# EAGLE design Recuperaçao (EAGLE 9.6.2)

## Sheet 1 of 3: Microcontrolador recuperação
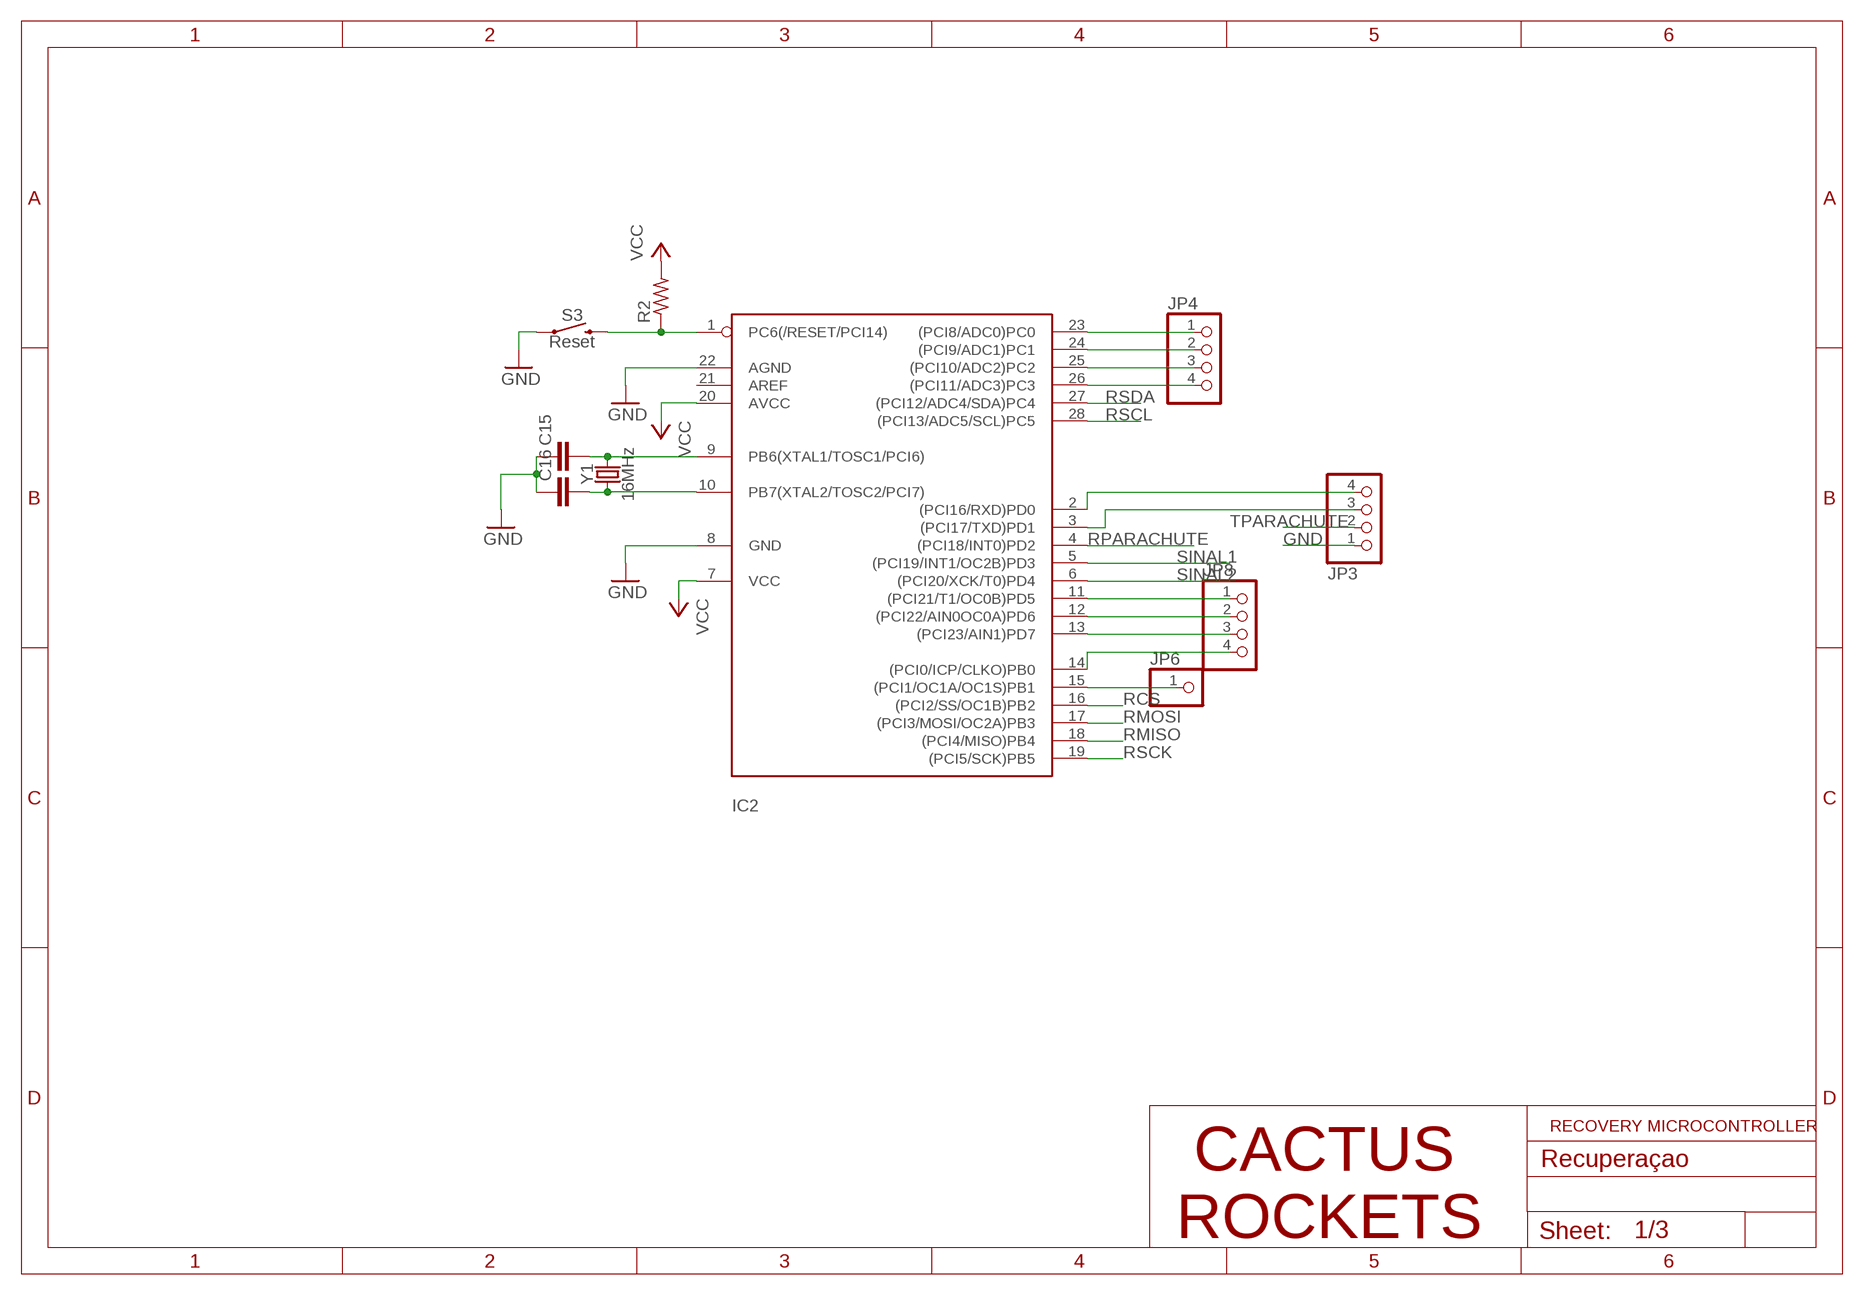
[diagram p0: schematic, sheet 1]

### Parts
C15  C-EU025-025X050  [C025-025X050]
C16  C-EU025-025X050  [C025-025X050]
IC2  ATMEGA328-20P  [DIL28-3]
JP3  PINHD-1X4/90  [1X04/90]
JP4  PINHD-1X4  [1X04]
JP6  PINHD-1X1  [1X01]
JP8  PINHD-1X4  [1X04]
R2  R-US_0207/10  [0207/10]
S3  Reset  MOMENTARY-SWITCH-SPST-PTH-6.0MM  [TACTILE_SWITCH_PTH_6.0MM]
Y1  16MHz  CRYSTAL-16MHZPTH-HC49US  [HC49US]

### Nets
GND: C15.1 C16.1 IC2.8(GND) IC2.22(AGND) JP3.1 S3.1 S3.2 ; also sheet 2,3
N$1: IC2.23((PCI8/ADC0)PC0) JP4.1
N$2: IC2.24((PCI9/ADC1)PC1) JP4.2
N$3: IC2.25((PCI10/ADC2)PC2) JP4.3
N$4: IC2.26((PCI11/ADC3)PC3) JP4.4
N$5: IC2.2((PCI16/RXD)PD0) JP3.4
N$8: IC2.11((PCI21/T1/OC0B)PD5) JP8.1
N$9: IC2.12((PCI22/AIN0OC0A)PD6) JP8.2
N$10: IC2.13((PCI23/AIN1)PD7) JP8.3
N$11: IC2.15((PCI1/OC1A/OC1S)PB1) JP6.1
N$12: IC2.14((PCI0/ICP/CLKO)PB0) JP8.4
N$13: C16.2 IC2.10(PB7(XTAL2/TOSC2/PCI7)) Y1.1
N$14: C15.2 IC2.9(PB6(XTAL1/TOSC1/PCI6)) Y1.2
N$15: IC2.3((PCI17/TXD)PD1) JP3.3
RCS: IC2.16((PCI2/SS/OC1B)PB2) ; also sheet 3
RESET: IC2.1(PC6(/RESET/PCI14)) R2.1 S3.3 S3.4
RMISO: IC2.18((PCI4/MISO)PB4) ; also sheet 3
RMOSI: IC2.17((PCI3/MOSI/OC2A)PB3) ; also sheet 3
RPARACHUTE: IC2.4((PCI18/INT0)PD2)
RSCK: IC2.19((PCI5/SCK)PB5) ; also sheet 3
RSCL: IC2.28((PCI13/ADC5/SCL)PC5) ; also sheet 2
RSDA: IC2.27((PCI12/ADC4/SDA)PC4) ; also sheet 2
SINAL1: IC2.5((PCI19/INT1/OC2B)PD3)
SINAL2: IC2.6((PCI20/XCK/T0)PD4)
TPARACHUTE: JP3.2
VCC: IC2.7(VCC) IC2.20(AVCC) R2.2 ; also sheet 2,3
Unconnected: IC2.21(AREF)

### Notes on the sheet
- RECOVERY MICROCONTROLLER
- CACTUS
  ROCKETS

## Sheet 2 of 3: MPU-6050
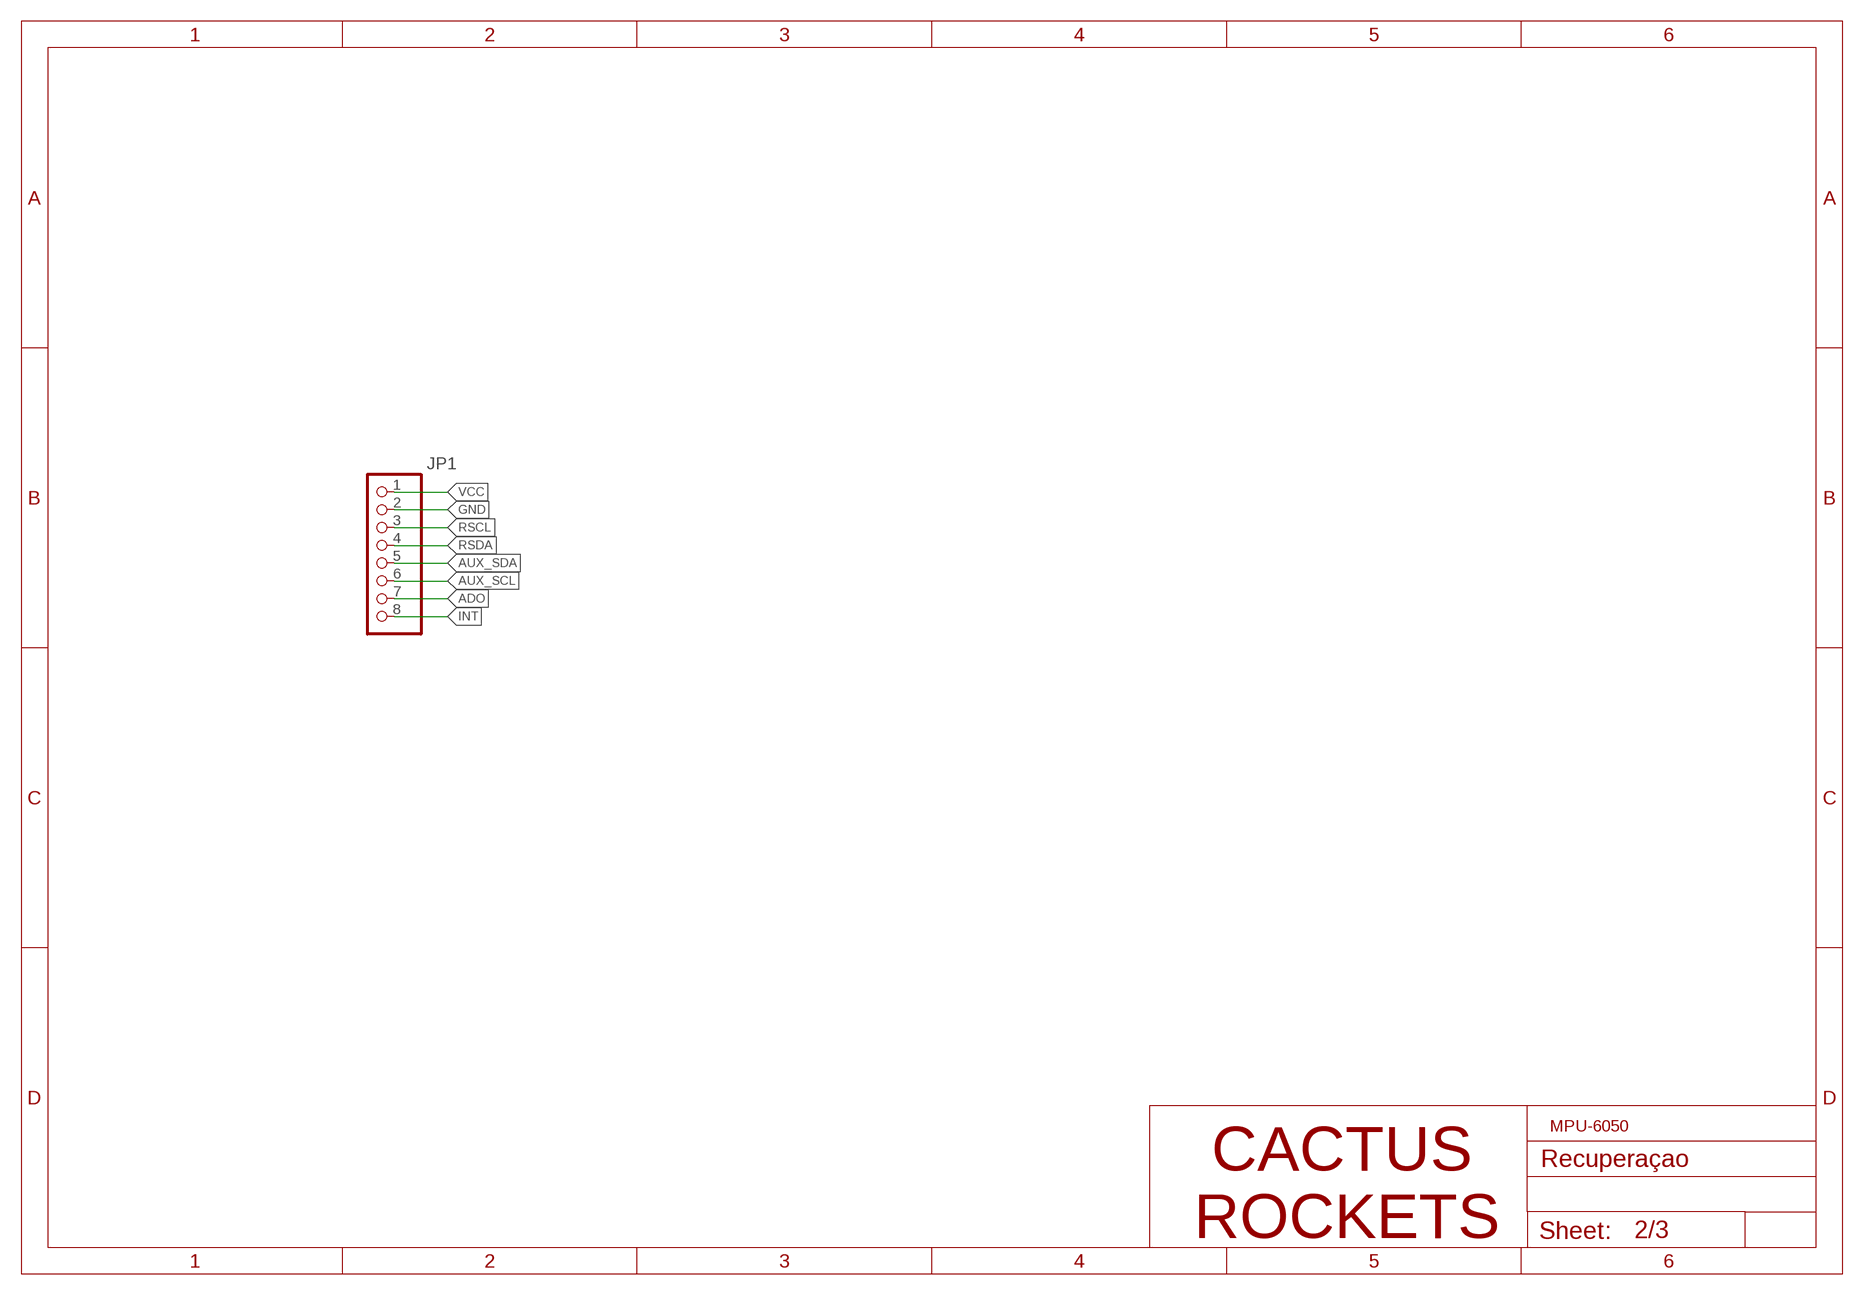
[diagram p1: schematic, sheet 2]

### Parts
JP1  PINHD-1X8  [1X08]

### Nets
ADO: JP1.7
AUX_SCL: JP1.6
AUX_SDA: JP1.5
GND: JP1.2 ; also sheet 1,3
INT: JP1.8
RSCL: JP1.3 ; also sheet 1
RSDA: JP1.4 ; also sheet 1
VCC: JP1.1 ; also sheet 1,3

### Notes on the sheet
- MPU-6050
- CACTUS
  ROCKETS

## Sheet 3 of 3: BMP280
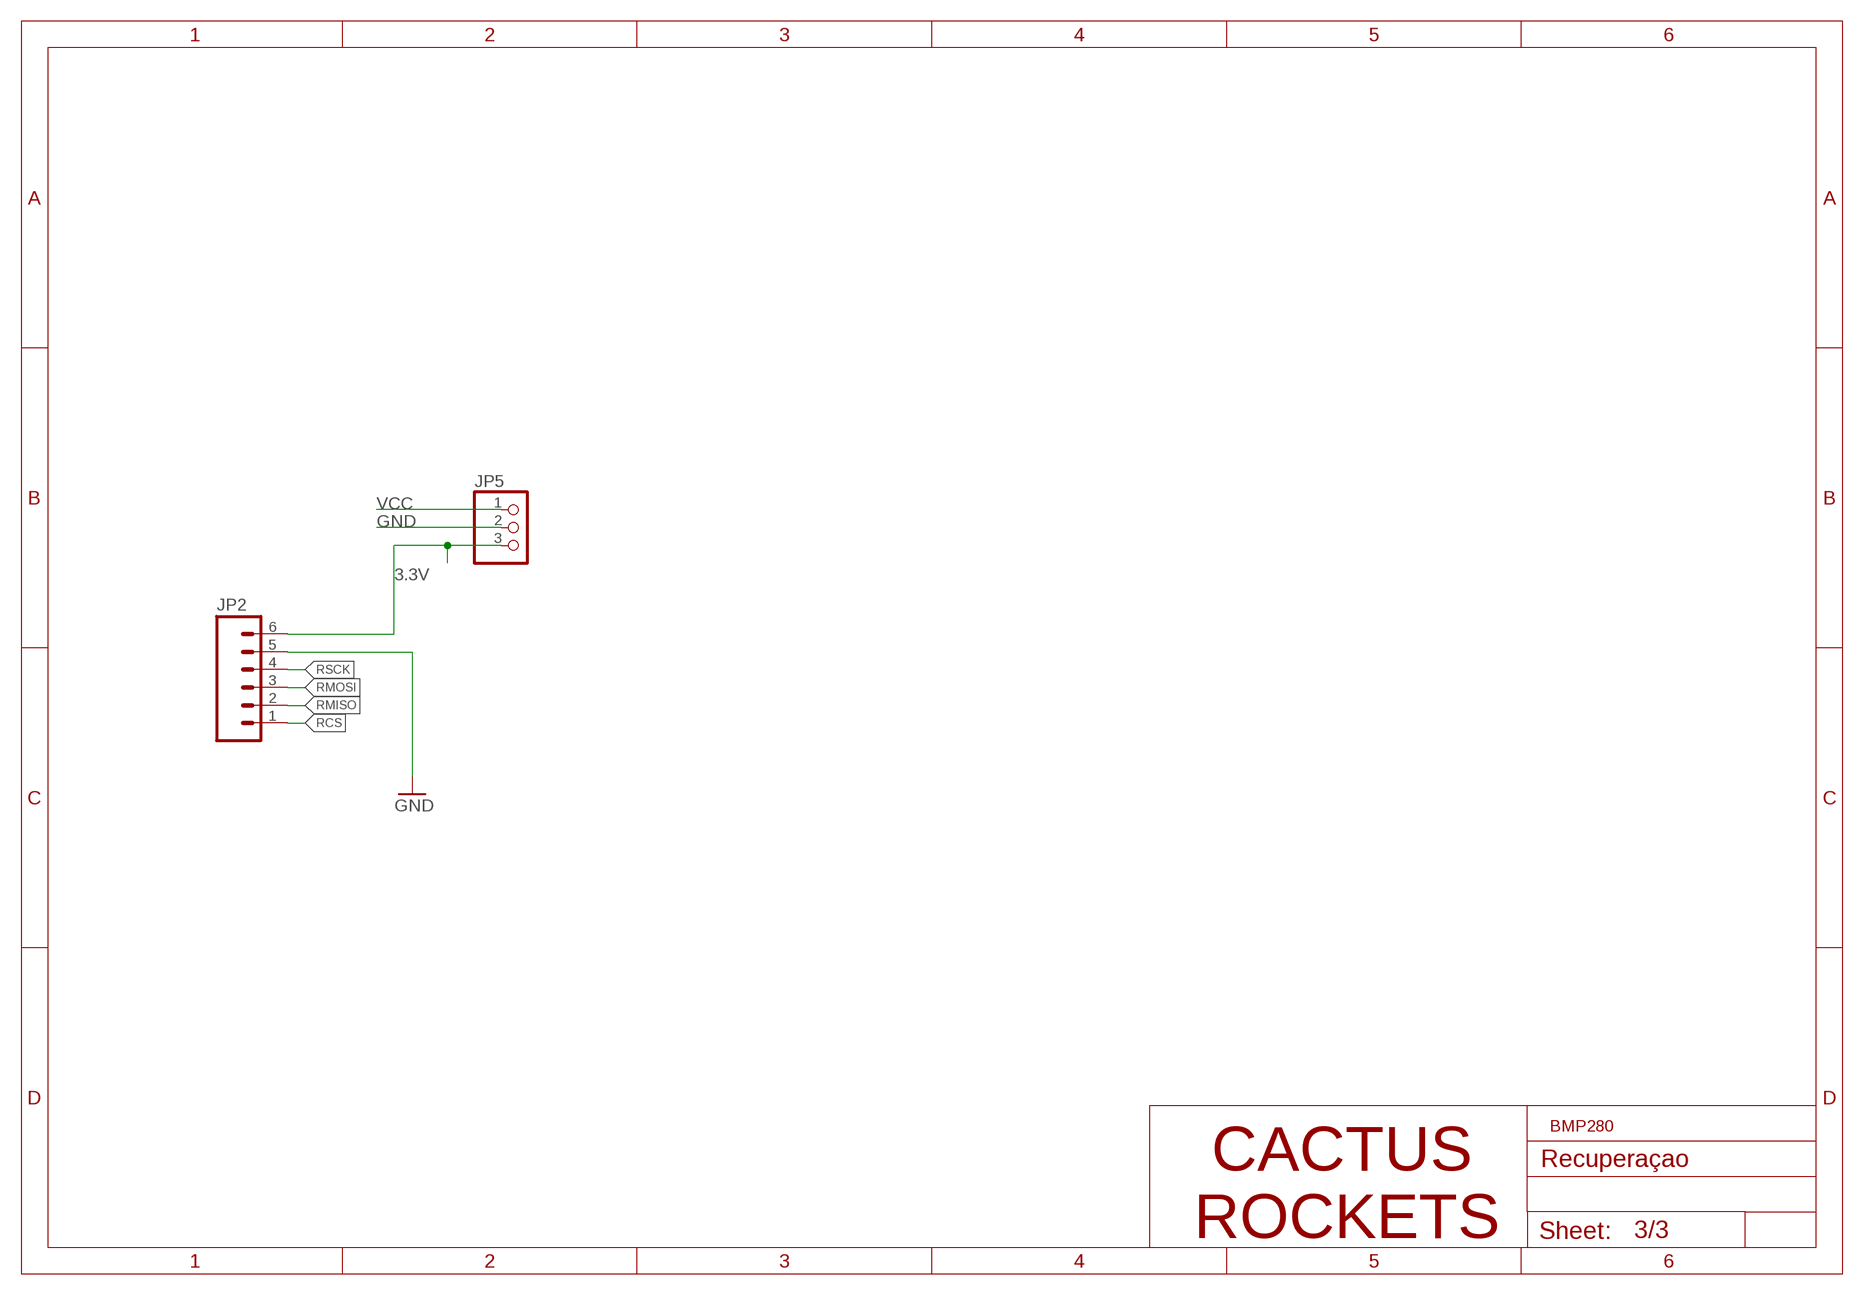
[diagram p2: schematic, sheet 3]

### Parts
JP2  M06NO_SILK_FEMALE_PTH  [1X06_NO_SILK]
JP5  PINHD-1X3/90  [1X03/90]

### Nets
3.3V: JP2.6 JP5.3
GND: JP2.5 JP5.2 ; also sheet 1,2
RCS: JP2.1 ; also sheet 1
RMISO: JP2.2 ; also sheet 1
RMOSI: JP2.3 ; also sheet 1
RSCK: JP2.4 ; also sheet 1
VCC: JP5.1 ; also sheet 1,2

### Notes on the sheet
- BMP280
- CACTUS
  ROCKETS

## Library data of the parts
C15 C16 = rcl:C-EU: CAPACITOR, European symbol; SPICEPREFIX: C
IC2 = atmega328:ATMEGA328*P: MICROCONTROLLER 32 kBytes FLASH 2 kBytes SRAM 1 kBytes EEPROM USART 8-channel 10 bit ADC
JP1 = pinhead:PINHD-1X8: PIN HEADER
JP2 = SparkFun-Connectors:M06: Header 6 Standard 6-pin 0.1" header. Use with straight break away headers (SKU : PRT-00116), right angle break away headers (PRT-00553), swiss pins (PRT-00743), machine pins (PRT-00117), and female headers (PRT-00115). Molex polarized connector foot print use with SKU : PRT-08094 with associated crimp pins and housings. NOTES ON THE VARIANTS LOCK and LOCK_LONGPADS... This footprint was designed to help hold the alignment of a through-hole component (i.e. 6-pin header) while soldering it into place. You may notice that each hole has been shifted either up or down by 0.005 of an inch from it's more standard position (which is a perfectly straight line). This slight alteration caused the pins (the squares in the middle) to touch the edges of the holes. Because they are alternating, it causes a "brace" to hold the component in place. 0.005 has proven to be the perfect amount of "off-center" position when using our standard breakaway headers. Although looks a little odd when you look at the bare footprint, once you have a header in there, the alteration is very hard to notice. Also,if you push a header all the way into place, it is covered up entirely on the bottom side. This idea of altering the position of holes to aid alignment will be further integrated into the Sparkfun Library for other footprints. It can help hold any component with 3 or more connection pins.; PROD_ID: CONN-08437
JP3 JP4 JP8 = pinhead:PINHD-1X4: PIN HEADER
JP5 = pinhead:PINHD-1X3: PIN HEADER
JP6 = pinhead:PINHD-1X1: PIN HEADER
R2 = rcl:R-US_: RESISTOR, American symbol; SPICEPREFIX: R
S3 = SparkFun-Switches:MOMENTARY-SWITCH-SPST: Momentary Switch (Pushbutton) - SPST Normally-open (NO) SPST momentary switches (buttons, pushbuttons). Variants PTH-12MM - 12mm square, through-hole Momentary Pushbutton Switch - 12mm Square <https://www.sparkfun.com/products/9190> (COM-09190) PTH-6.0MM, PTH-6.0MM-KIT - 6.0mm square, through-hole Mini Pushbutton Switch <https://www.sparkfun.com/products/97> (COM-00097) KIT package intended for soldering kit's - only one side of pads' copper is exposed. PTH-RIGHT-ANGLE-KIT - Right-angle, through-hole Right Angle Tactile Button <https://www.sparkfun.com/products/10791> - Used on SparkFun BigTime Watch Kit <https://www.sparkfun.com/products/11734> SMD-12MM - 12mm square, surface-mount Tactile Button - SMD (12mm) <https://www.sparkfun.com/products/12993> (COM-12993) Used on SparkFun PicoBoard <https://www.sparkfun.com/products/11888> SMD-4.5MM - 4.5mm Square Trackball Switch Used on SparkFun Blackberry Trackballer Breakout <https://www.sparkfun.com/products/13169> SMD-4.6MMX2.8MM - 4.60mm x 2.80mm, surface mount Used on SparkFun Pro Micro - RP2040 <https://www.sparkfun.com/products/17717> SMD-5.2MM, SMD-5.2-REDUNDANT - 5.2mm square, surface-mount Mini Pushbutton Switch - SMD <https://www.sparkfun.com/products/8720> (COM-08720) Used on Arduino Pro Mini <https://www.sparkfun.com/products/11114> REDUNDANT package connects both switch circuits together SMD-6.0X3.5MM - 6.0 x 3.5mm, surface mount Momentary Reset Switch SMD <https://www.sparkfun.com/products/8229> (COM-08229) SMD-6.2MM-TALL - 6.2mm square, surface mount Tactile Button - SMD (6mm) <https://www.sparkfun.com/products/12992> Used on SparkFun Digital Sandbox <https://www.sparkfun.com/products/12651> SMD-RIGHT-ANGLE - Right-angle, surface mount Used on SparkFun Block for Intel® Edison - Arduino <https://www.sparkfun.com/products/13036>; PROD_ID: SWCH-08441; SF_SKU: COM-00097
Y1 = SparkFun-Clocks:CRYSTAL-16MHZ: 16MHz Crystal Digikey Example <http://www.digikey.com/product-search/en?keywords=535-9122-1-ND> Frequency: 16MHz Frequency Stability: ±50ppm Frequency Tolerance: ±20ppm Load Capacitance: 18pF SparkFun Products: Pro Micro -5V/16MHz <https://www.sparkfun.com/products/12640> SparkFun Serial Enabled LCD Kit <https://www.sparkfun.com/products/10097>; PROD_ID: XTAL-08181; SF_ID: COM-00536

## Board
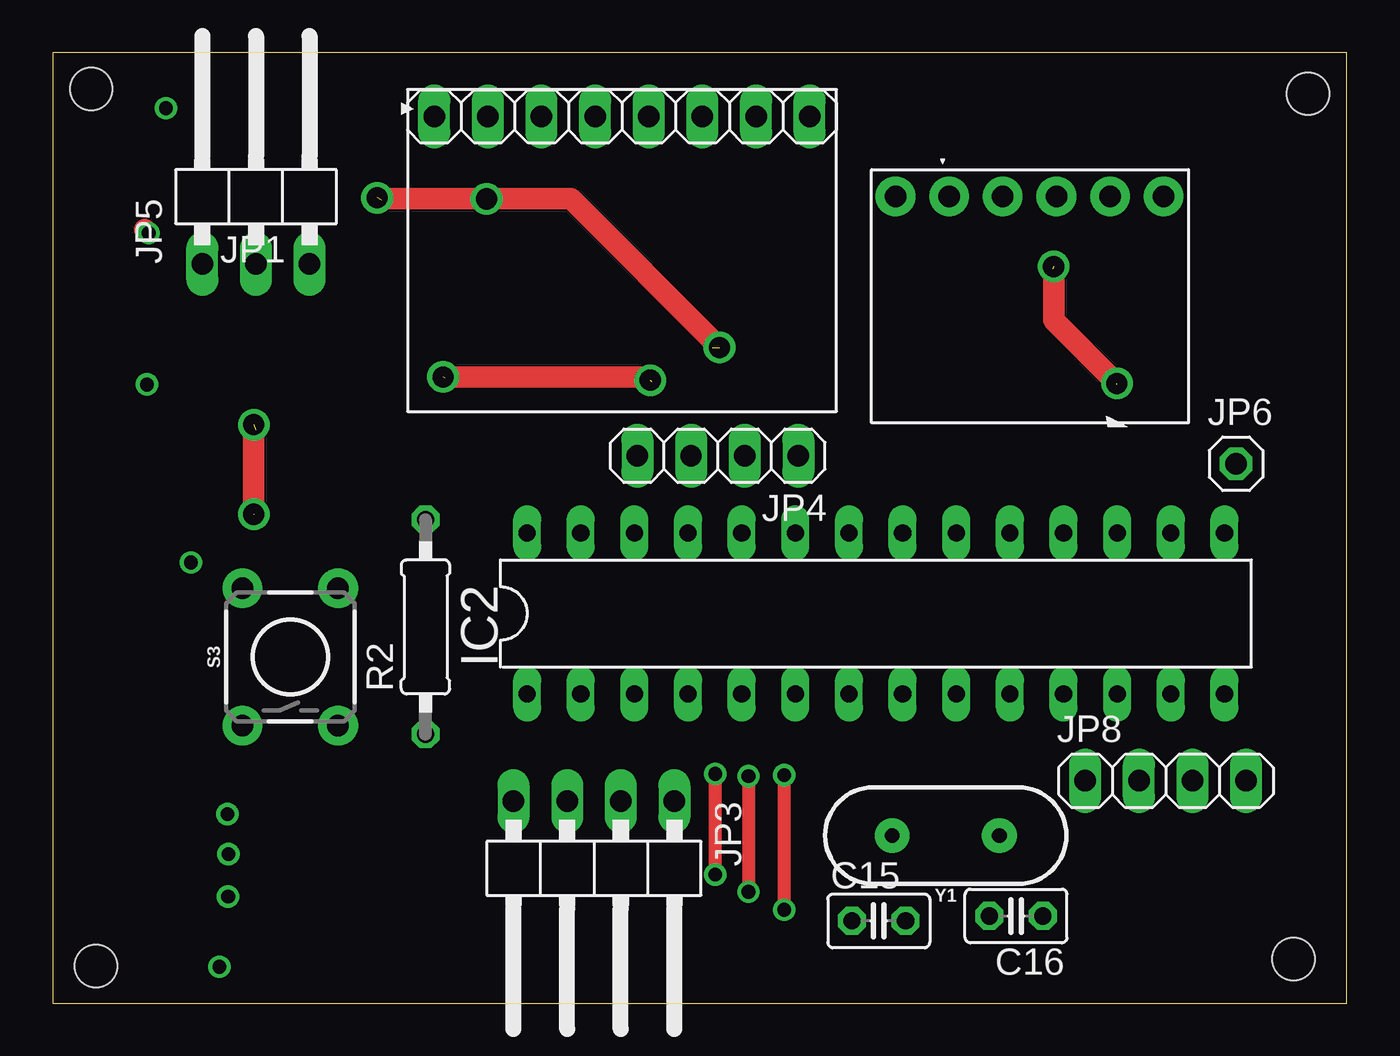
[diagram p3: board, top side]
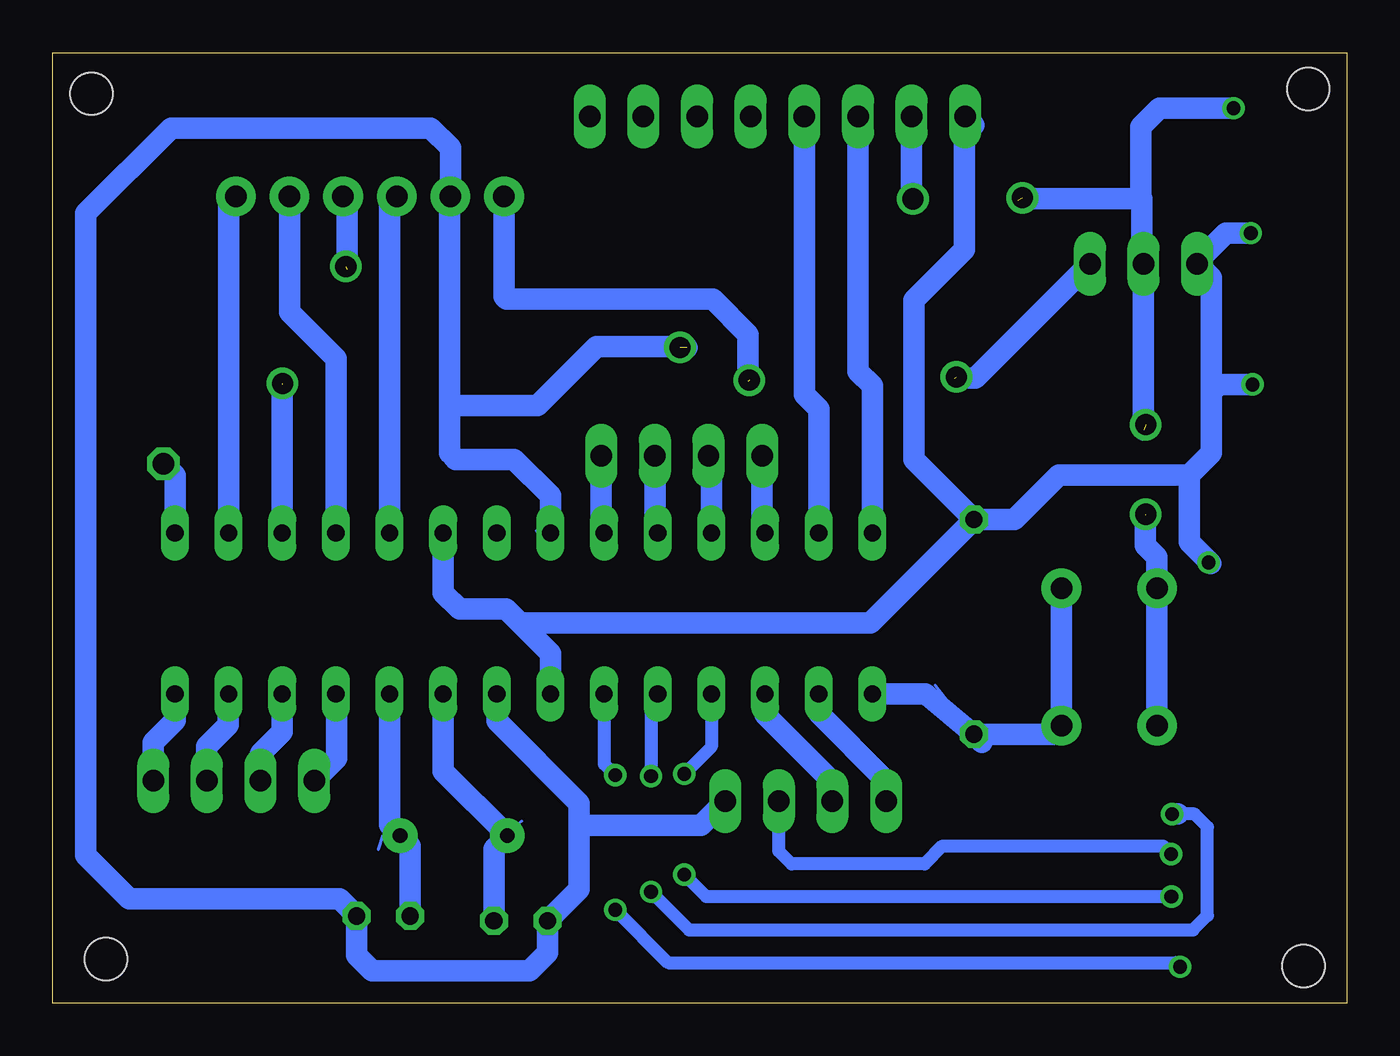
[diagram p4: board, bottom side, seen from below]

Size 61.27 x 45 mm. Coordinates in mm from the lower left corner, seen from the top.
Outline: 0,0 61.27,0 61.27,45 0,45 0,0
Copper layers (1*16): Top 0.035mm / dielectric 1.5mm / Bottom 0.035mm
Design rules "default": minimum track width 6mil, minimum drill 0.35mm, track to track 6mil, track to pad 6mil, pad to pad 6mil, via to via 6mil, smd to smd 6mil, copper to edge 40mil, drill to drill 6mil, minimum pad ring 10mil, minimum via ring 8mil, stop-mask expansion 4mil, vias tented up to drill 0mil, thermal gap 10mil
Holes 2 mm at 1.82,43.29 2.05,1.76 58.74,2.09 59.43,43.06

### Footprints (pad centres in the part's own frame; a part is rotated, then mirrored left to right if it is on the bottom)
C025-025X050 = drill 0.813 octagon: 1 -1.27,0; 2 1.27,0
DIL28-3 = drill 0.813 long: 1 -16.51,-3.81; 2 -13.97,-3.81; 3 -11.43,-3.81; 4 -8.89,-3.81; 5 -6.35,-3.81; 6 -3.81,-3.81; 7 -1.27,-3.81; 8 1.27,-3.81; 9 3.81,-3.81; 10 6.35,-3.81; 11 8.89,-3.81; 12 11.43,-3.81; 13 13.97,-3.81; 14 16.51,-3.81; 15 16.51,3.81; 16 13.97,3.81; 17 11.43,3.81; 18 8.89,3.81; 19 6.35,3.81; 20 3.81,3.81; 21 1.27,3.81; 22 -1.27,3.81; 23 -3.81,3.81; 24 -6.35,3.81; 25 -8.89,3.81; 26 -11.43,3.81; 27 -13.97,3.81; 28 -16.51,3.81
1X08 = drill 1.016 long: 1 -8.89,0; 2 -6.35,0; 3 -3.81,0; 4 -1.27,0; 5 1.27,0; 6 3.81,0; 7 6.35,0; 8 8.89,0
1X06_NO_SILK = drill 1.016 pad 1.88: 1 0,0; 2 2.54,0; 3 5.08,0; 4 7.62,0; 5 10.16,0; 6 12.7,0
1X04/90 = drill 1.016 long: 1 -3.81,-3.81; 2 -1.27,-3.81; 3 1.27,-3.81; 4 3.81,-3.81
1X04 = drill 1.016 long: 1 -3.81,0; 2 -1.27,0; 3 1.27,0; 4 3.81,0
1X03/90 = drill 1.016 long: 1 -2.54,-3.81; 2 0,-3.81; 3 2.54,-3.81
1X01 = drill 1.016 octagon: 1 0,0
0207/10 = drill 0.813 octagon: 1 -5.08,0; 2 5.08,0
TACTILE_SWITCH_PTH_6.0MM = drill 1.016 pad 1.88: 1 -3.251,2.261; 2 3.251,2.261; 3 -3.251,-2.261; 4 3.251,-2.261
HC49US = drill 0.7 pad 1.651: 1 -2.54,0; 2 2.54,0

### Placement (x,y rotation side)
C15  39.11,3.89 0 top
C16  45.61,4.12 180 top
IC2  38.97,18.45 0 top
JP1  26.95,41.99 0 top
JP2  52.6,38.2 180 top
JP3  25.62,5.75 180 top
JP4  31.49,25.92 180 top
JP5  9.62,38.82 0 top
JP6  56.03,25.54 0 top
JP8  52.7,10.52 0 top
R2  17.65,17.81 90 top
S3  11.25,16.39 90 top
Y1  42.28,7.93 180 top

### Tracks (layer width: path | path; a pad name or v marks a point on that pad's centre or on a via)
3.3V  (via drill 1)  (2 unrouted)
  Top 1.016: v18.48,29.65 28.14,29.65 v28.29,29.5
  Bottom 1.016: JP5.3 17.57,29.6 18.59,29.6 | JP2.6 39.9,33.46 39.77,33.33 30.02,33.33 28.34,31.66 28.34,29.42
GND  (via drill 0.65, 1)  (4 unrouted)
  Top 1.016: 20.69,41.9 JP1.2 | v5.35,42.38 5.38,42.35 | v31.57,31.05 24.53,38.08 v20.54,38.08 15.41,38.08 v15.36,38.13 | v9.52,27.39 v9.52,23.15
  Bottom 0.152: 29.51,9.51 JP3.1 | 38.37,22.36 37.76,22.36 37.72,22.3 IC2.22 | 20.69,41.87 20.61,41.98 JP1.2 | 42.49,38.06 42.48,38.08 JP2.5
  Bottom 1.016: JP2.5 42.44,40.5 43.38,41.44 55.67,41.44 59.71,37.4 59.71,6.99 57.65,4.94 47.69,4.94 C16.1 46.88,2.26 46.14,1.52 38.69,1.52 37.84,2.37 C15.1 36.34,5.39 36.34,8.42 | IC2.8 40.24,13.36 36.34,9.46 36.34,8.42 | 29.2,9.33 JP3.1 30.57,8.42 36.34,8.42 | 20.45,41.82 20.61,41.98 | 9.7,38.08 9.7,35.09 JP5.2 9.62,27.16 9.59,27.14 | S3.1 S3.2 8.98,21.12 9.54,21.67 9.54,23.15 | IC2.22 37.7,24.02 39.41,25.74 42.18,25.74 42.48,26.04 42.48,28.3 | 42.48,28.3 42.48,38.08 | 9.7,38.08 15.51,38.08 15.56,38.03 | JP1.2 20.6,38.14 v20.54,38.08 20.49,38.03 | 42.48,28.3 38.32,28.3 35.53,31.1 31.29,31.1 31.23,31.05 | v5.35,42.38 8.88,42.38 9.75,41.51 9.75,38.13 9.7,38.08
N$1
  Bottom 0.152: 35.17,22.36 IC2.23 | 35.17,25.87 JP4.1
  Bottom 1.016: JP4.1 35.3,22.4 IC2.23
N$2
  Bottom 0.152: 32.73,22.36 IC2.24 | 32.73,25.87 JP4.2
  Bottom 1.016: JP4.2 32.76,22.4 IC2.24
N$3
  Bottom 0.152: 30.14,22.36 IC2.25 | 30.14,25.87 JP4.3
  Bottom 1.016: IC2.25 30.08,25.78 JP4.3
N$4
  Bottom 0.152: 27.55,22.36 IC2.26 | 27.55,25.87 JP4.4
  Bottom 1.016: JP4.4 27.68,22.4 IC2.26
N$5
  Bottom 0.152: 24.49,14.59 24.96,14.59 IC2.2
  Bottom 1.016: IC2.2 25,13.71 21.81,10.52 JP3.4
N$8
  Bottom 0.152: 47.82,14.59 IC2.11
  Bottom 1.016: 47.87,14.63 IC2.11 | JP8.1 47.82,11.59 47.82,14.59
N$9
  Bottom 0.152: 50.41,14.59 IC2.12
  Bottom 1.016: 50.41,14.63 IC2.12 50.4,12.85 51.43,11.82 JP8.2
N$10
  Bottom 0.152: 53,14.59 IC2.13
  Bottom 1.016: IC2.13 52.95,14.63 52.95,13.17 53.97,12.15 JP8.3
N$11
  Bottom 1.016: IC2.15 55.48,24.99 JP6.1
N$12
  Bottom 1.016: JP8.4 56.51,12.35 55.48,13.38 IC2.14
N$13
  Bottom 0.152: 45.84,7.27 45.62,7.93 Y1.1 44.7,8.01 | 45.38,14.59 IC2.10
  Bottom 1.016: IC2.10 45.32,8.43 Y1.1 44.34,7.45 C16.2
N$14
  Bottom 0.152: Y1.2 39.06,8.62 | 42.64,14.59 IC2.9
  Bottom 1.016: IC2.9 42.78,10.97 Y1.2 40.38,7.3 C15.2
N$15
  Bottom 0.152: 27.37,14.59 27.4,14.59 IC2.3
  Bottom 1.016: IC2.3 27.54,13.66 24.35,10.47 JP3.3
N$38  (via drill 0.65)
  other vias: 6.55,20.86
RCS
  Bottom 0.152: 52.85,37.91 52.7,38.06 JP2.1 | 52.85,22.36 IC2.16
  Bottom 1.016: IC2.16 52.94,37.86 JP2.1
RESET
  Bottom 0.152: 22.07,15.05 22.37,14.74 IC2.1 | 19.47,15.05 R2.1
  Bottom 1.016: R2.1 19.95,14.64 IC2.1 | 17.26,12.35 R2.1 | S3.4 S3.3 13.91,12.73 R2.1
RMISO
  Bottom 0.152: 47.97,22.36 IC2.18
  Bottom 1.016: IC2.18 47.86,30.53 50.06,32.73 JP2.2
RMOSI  (via drill 1)  (2 unrouted)
  Top 1.016: v50.39,29.35 47.39,32.34 v47.39,34.88
  Bottom 0.152: 50.41,22.36 IC2.17 | 47.67,38.21 47.54,38.2 JP2.3
  Bottom 1.016: 47.34,34.76 47.34,38 47.54,38.2 | 50.39,29.29 50.4,29.28 IC2.17
RPARACHUTE  (via drill 0.65)
  Top 0.61: v31.36,10.85 v31.36,6.08 31.36,6.03 | 8.15,5.19 v8.3,5.04
  Bottom 0.61: IC2.4 30.08,12.14 v31.36,10.85 31.39,10.83 | v31.36,6.08 30.32,5.04 v8.3,5.04
RSCK
  Bottom 0.152: 45.23,37.91 45.08,38.06 JP2.4 | 45.23,22.36 IC2.19
  Bottom 1.016: JP2.4 45.32,37.86 IC2.19
RSCL
  Bottom 0.152: 22.52,41.26 23.13,41.87 JP1.3 | 22.52,22.36 IC2.28
  Bottom 1.016: JP1.3 23.14,29.91 22.46,29.23 IC2.28
RSDA
  Bottom 0.152: 25.11,41.41 25.57,41.87 JP1.4 | 25.11,22.36 IC2.27
  Bottom 1.016: JP1.4 25.68,28.82 25,28.14 IC2.27
SINAL1  (via drill 0.65)
  Top 0.61: v32.94,10.75 v32.94,5.27
  Bottom 0.61: IC2.5 32.94,14.32 v32.94,10.75 | v32.94,5.27 31.13,3.46 7.28,3.46 6.6,4.15 6.6,8.34 7.21,8.95 7.99,8.95 | v8.27,8.95 8.32,8.95
  Bottom 1.016: 7.99,8.95 v8.27,8.95
SINAL2  (via drill 0.65)
  Top 0.61: v34.63,10.79 v34.63,4.42 | v7.89,1.72 7.88,1.71
  Bottom 0.152: IC2.6
  Bottom 0.61: IC2.6 35.16,11.32 v34.63,10.79 34.54,10.7 | v34.63,4.42 32.12,1.91 8.08,1.91 v7.89,1.72
TPARACHUTE  (via drill 0.65)
  Top 0.61: 8.22,6.97 v8.31,7.06
  Bottom 0.61: JP3.2 26.89,7.2 26.28,6.59 19.98,6.59 19.13,7.44 8.69,7.44 v8.31,7.06
VCC  (via drill 0.65)
  Top 1.016: 4.36,36.64 v4.54,36.46
  Bottom 0.152: 37.76,14.74 IC2.7 | 42.64,22.21 IC2.20 | 17.95,41.87 18.03,41.96 JP1.1 18.1,42.02
  Bottom 0.61: JP5.1 7.08,34.7 | IC2.20 42.78,23.08
  Bottom 1.016: IC2.7 37.7,16.56 39.13,17.99 | IC2.20 42.78,19.43 42,18.65 39.79,18.65 39.13,17.99 | R2.2 22.55,17.99 39.13,17.99 | 17.65,41.57 18.03,41.96 | 7.08,34.7 7.28,34.91 5.73,36.46 v4.54,36.46 | 6.88,35.21 JP5.1 6.42,34.35 6.42,28.94 | R2.2 20.49,25.74 20.49,33.28 18.1,35.67 18.1,42.02 | R2.2 15.74,22.89 13.63,25 7.46,25 | 7.46,25 6.42,26.04 6.42,28.94 | 7.46,25 7.46,21.83 6.44,20.81 | v4.46,29.29 6.06,29.29 6.42,28.94